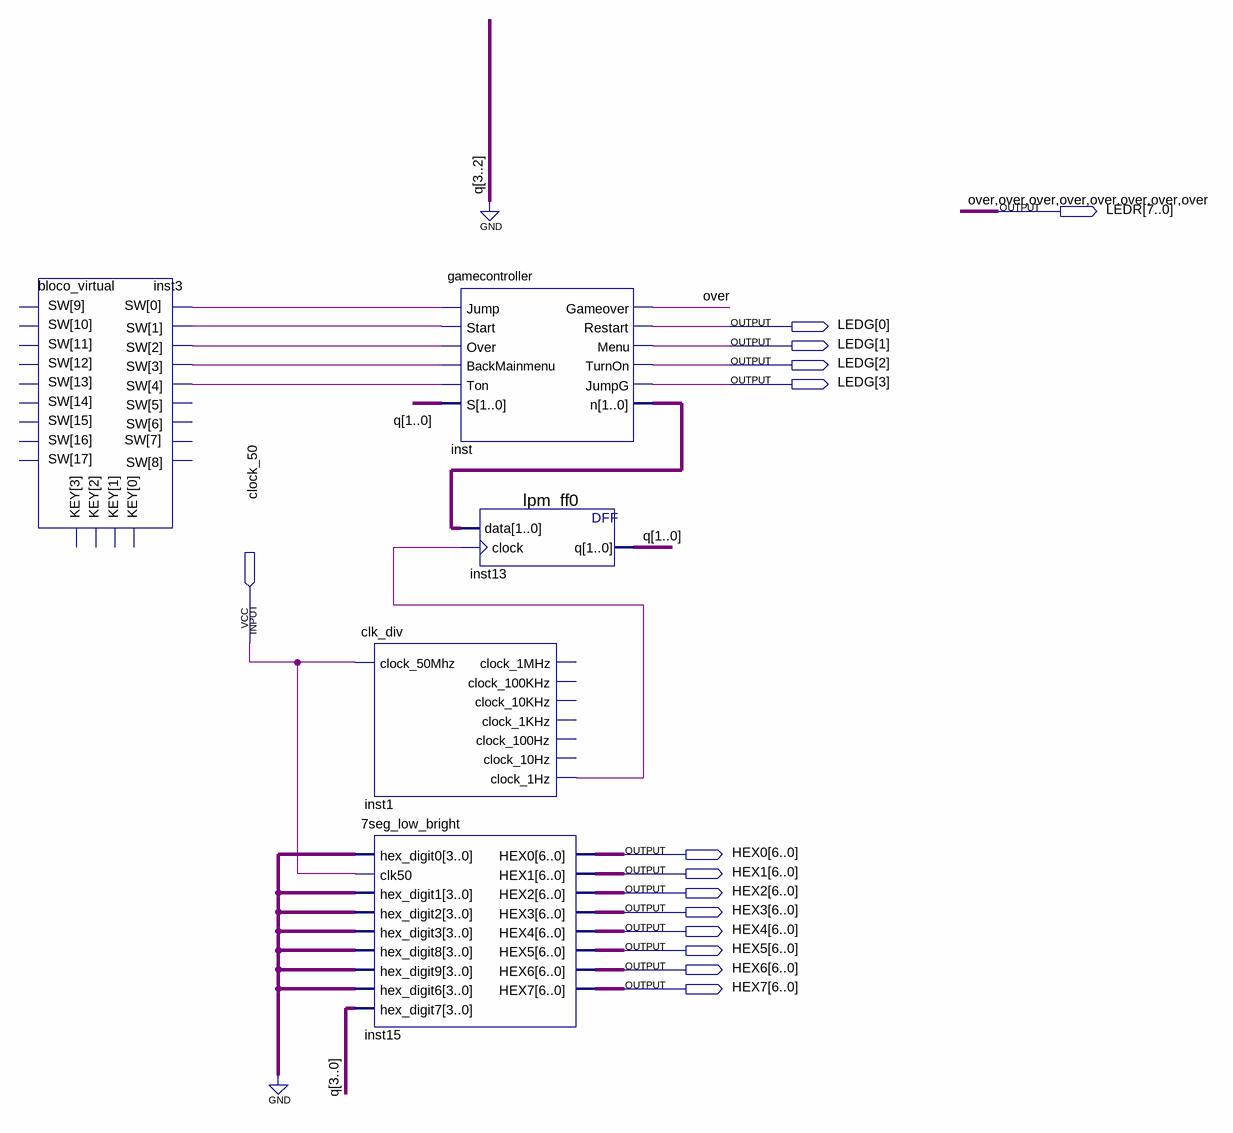
[diagram p0: schematic sheet]
// Quartus schematic TESTE_CONTROLLER.bdf as structural Verilog: 5 symbols, 14 pins
module TESTE_CONTROLLER (
  input  clock_50,
  output [7:0] LEDR,
  output [3:0] LEDG,
  output [6:0] HEX0,
  output [6:0] HEX1,
  output [6:0] HEX2,
  output [6:0] HEX3,
  output [6:0] HEX4,
  output [6:0] HEX5,
  output [6:0] HEX6,
  output [6:0] HEX7
);

  wire inst1_clock_1hz, inst3_sw, inst3_sw_2, inst3_sw_3, inst3_sw_4, inst3_sw_5;
  wire [1:0] inst_n, q;
  wire [17:0] inst3_sw_open;  // unused outputs

  bloco_virtual inst3 (.SW({inst3_sw_open[17:5], inst3_sw_3, inst3_sw_2, inst3_sw_5, inst3_sw_4, inst3_sw}));  // open: KEY
  clk_div inst1 (
    .clock_50Mhz(clock_50), .clock_1Hz(inst1_clock_1hz));  // open: clock_1MHz, clock_100KHz, clock_10KHz, clock_1KHz, clock_100Hz, clock_10Hz
  \7seg_low_bright  inst15 (
    .hex_digit0(4'b0000), .clk50(clock_50), .hex_digit1(4'b0000), .hex_digit2(4'b0000), .hex_digit3(4'b0000),
    .hex_digit8(4'b0000), .hex_digit9(4'b0000), .hex_digit6(4'b0000), .hex_digit7({2'b00, q}), .HEX0(HEX0),
    .HEX1(HEX1), .HEX2(HEX2), .HEX3(HEX3), .HEX4(HEX4), .HEX5(HEX5), .HEX6(HEX6), .HEX7(HEX7));
  gamecontroller inst (
    .Jump(inst3_sw), .Start(inst3_sw_4), .Over(inst3_sw_5), .BackMainmenu(inst3_sw_2), .Ton(inst3_sw_3),
    .S(q), .Gameover(LEDR[7]), .Restart(LEDG[0]), .Menu(LEDG[1]), .TurnOn(LEDG[2]), .JumpG(LEDG[3]),
    .n(inst_n));
  lpm_ff0 inst13 (.data(inst_n), .clock(inst1_clock_1hz), .q(q));

  assign LEDR[6:0] = {7{LEDR[7]}};

  // Other names for the same wires on the sheet: over = LEDR[7]
endmodule
